# EAGLE design BusPirate-v4_ecard (EAGLE 8.4.0)
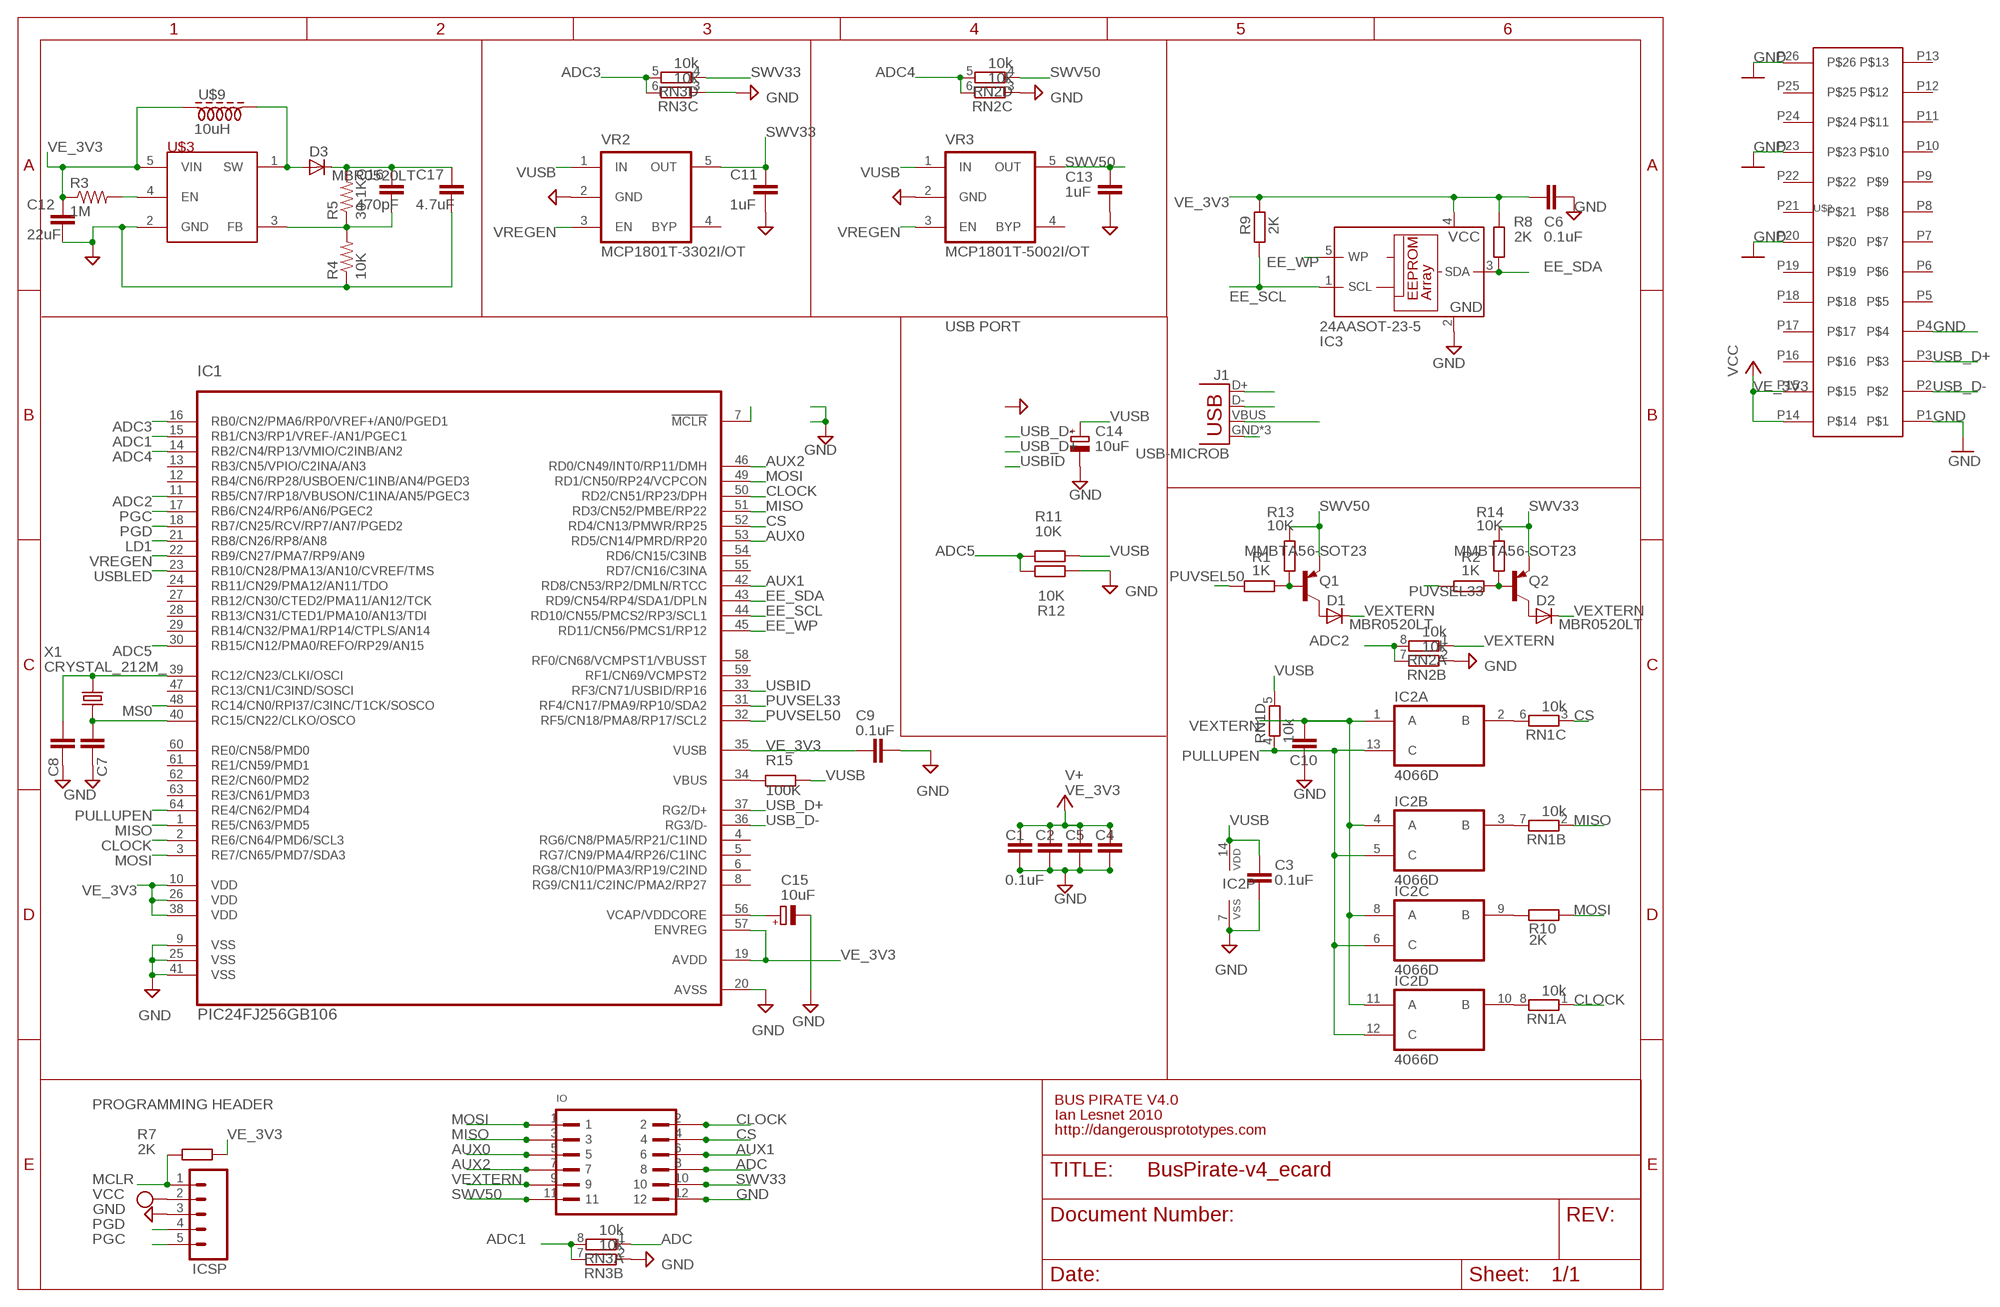
[diagram p0: schematic, sheet 1]

## Parts
C1  0.1uF  C-EUC0603  [C0603]
C2  0.1uF  C-EUC0603  [C0603]
C3  0.1uF  C-EUC0603  [C0603]
C4  0.1uF  C-EUC0603  [C0603]
C5  0.1uF  C-EUC0603  [C0603]
C6  0.1uF  C-EUC0603  [C0603]
C7  27pF  C-EUC0603  [C0603]
C8  27pF  C-EUC0603  [C0603]
C9  0.1uF  C-EUC0603  [C0603]
C10  0.1uF  C-EUC0603  [C0603]
C11  1uF  C-EUC0603  [C0603]
C12  22uF  C-EUC0603  [C0603]
C13  1uF  C-EUC0603  [C0603]
C14  10uF  CPOL-EUSMCA  [SMC_A]
C15  10uF  CPOL-EUSMCA  [SMC_A]
C16  470pF  C-EUC0603  [C0603]
C17  4.7uF  C-EUC0603  [C0603]
D1  MBR0520LT  [SOD123]
D2  MBR0520LT  [SOD123]
D3  MBR0520LT  [SOD123]
IC1  PIC24FJ256GB106  [TQFP64-10X10]
IC2  4066D  [SO14]
IC3  24AASOT-23-5  24AA  [SOT-23-5]
ICSP  ICSP  M05  [1X05]
IO  PINSHRD-PTH-2X06  [PINSHRD_PTH_2X06]
J1  USB-MICROB  [USB-MICROB]
Q1  MMBTA56-SOT23  [SOT23]
Q2  MMBTA56-SOT23  [SOT23]
R1  1K  R-EU_R0603  [R0603]
R2  1K  R-EU_R0603  [R0603]
R3  1M  R-US_R0603  [R0603]
R4  10K  R-US_R0603  [R0603]
R5  30.1K  R-US_R0603  [R0603]
R7  2K  R-EU_R0603  [R0603]
R8  2K  R-EU_R0603  [R0603]
R9  2K  R-EU_R0603  [R0603]
R10  2K  R-EU_R0603  [R0603]
R11  10K  R-EU_R0603  [R0603]
R12  10K  R-EU_R0603  [R0603]
R13  10K  R-EU_R0603  [R0603]
R14  10K  R-EU_R0603  [R0603]
R15  100K  R-EU_R0603  [R0603]
RN1  10k  RNETWORK  [RN8P-4R-CRA06S]
RN2  10k  RNETWORK  [RN8P-4R-CRA06S]
RN3  10k  RNETWORK  [RN8P-4R-CRA06S]
U$2  EXPRESSCARD  [EXPRESSCARD_EXPRESSCARD_PACK]
U$3  LMR62421  [SOT23-DBV]
U$9  10uH  SMD_IND  [2520(1008)]
VR2  MCP1801T-3302I/OT  MIC5205  [SOT-23-5]
VR3  MCP1801T-5002I/OT  MIC5205  [SOT-23-5]
X1  CRYSTAL_212M_  [4X6]

## Nets
ADC: IO.8 RN3.1
ADC1: IC1.15(RB1/CN3/RP1/VREF-/AN1/PGEC1) RN3.7 RN3.8
ADC2: IC1.11(RB5/CN7/RP18/VBUSON/C1INA/AN5/PGEC3) RN2.7 RN2.8
ADC3: IC1.16(RB0/CN2/PMA6/RP0/VREF+/AN0/PGED1) RN3.5 RN3.6
ADC4: IC1.14(RB2/CN4/RP13/VMIO/C2INB/AN2) RN2.5 RN2.6
ADC5: IC1.30(RB15/CN12/PMA0/REFO/RP29/AN15) R11.2 R12.2
AUX0: IC1.53(RD5/CN14/PMRD/RP20) IO.5
AUX1: IC1.42(RD8/CN53/RP2/DMLN/RTCC) IO.6
AUX2: IC1.46(RD0/CN49/INT0/RP11/DMH) IO.7
CLOCK: IC1.2(RE6/CN64/PMD6/SCL3) IC1.50(RD2/CN51/RP23/DPH) IO.2 RN1.1
CS: IC1.52(RD4/CN13/PMWR/RP25) IO.4 RN1.3
EE_SCL: IC1.44(RD10/CN55/PMCS2/RP3/SCL1) IC3.1(SCL) R9.1
EE_SDA: IC1.43(RD9/CN54/RP4/SDA1/DPLN) IC3.3(SDA) R8.1
EE_WP: IC1.45(RD11/CN56/PMCS1/RP12) IC3.5(WP)
GND: C1.2 C2.2 C3.2 C4.2 C5.2 C6.2 C7.2 C8.2 C9.2 C10.2 C11.2 C12.2 C13.2 C14.- C15.- C17.2 IC1.9(VSS) IC1.20(AVSS) IC1.25(VSS) IC1.41(VSS) IC2.7(P:VSS) IC3.2(GND) ICSP.3 IO.12 J1.GND J1.MT1(GND) J1.MT2(GND) R4.1 R12.1 RN2.2 RN2.3 RN3.2 RN3.3 U$2.P1 U$2.P4 U$2.P20 U$2.P23 U$2.P26 U$3.2(GND) VR2.2(GND) VR3.2(GND)
LD1: IC1.21(RB8/CN26/RP8/AN8)
MCLR: IC1.7(!MCLR) ICSP.1 R7.1
MISO: IC1.1(RE5/CN63/PMD5) IC1.51(RD3/CN52/PMBE/RP22) IO.3 RN1.2
MOSI: IC1.3(RE7/CN65/PMD7/SDA3) IC1.49(RD1/CN50/RP24/VCPCON) IO.1 R10.1
MS0: IC1.48(RC14/CN0/RPI37/C3INC/T1CK/SOSCO)
N$1: IC2.9(C:B) R10.2
N$2: IC2.10(D:B) RN1.8
N$3: D1.A Q1.3(C)
N$4: IC2.2(A:B) RN1.6
N$5: IC2.3(B:B) RN1.7
N$6: D3.A U$3.1(SW) U$9.2
N$7: R3.2 U$3.4(EN)
N$8: Q2.1(B) R2.1 R14.2
N$9: C7.1 IC1.40(RC15/CN22/CLKO/OSCO) X1.2(X2)
N$10: C15.+ IC1.56(VCAP/VDDCORE)
N$11: IC1.34(VBUS) R15.2
N$12: C8.1 IC1.39(RC12/CN23/CLKI/OSCI) X1.1(X1)
N$14: D2.A Q2.3(C)
N$15: C16.2 R4.2 R5.1 U$3.3(FB)
N$17: Q1.1(B) R1.1 R13.2
PGC: IC1.17(RB6/CN24/RP6/AN6/PGEC2) ICSP.5
PGD: IC1.18(RB7/CN25/RCV/RP7/AN7/PGED2) ICSP.4
PULLUPEN: IC1.64(RE4/CN62/PMD4) IC2.5(B:C) IC2.6(C:C) IC2.12(D:C) IC2.13(A:C) RN1.4
PUVSEL33: IC1.31(RF4/CN17/PMA9/RP10/SDA2) R2.2
PUVSEL50: IC1.32(RF5/CN18/PMA8/RP17/SCL2) R1.2
SWV33: C11.1 IO.10 Q2.2(E) R14.1 RN3.4 VR2.5(OUT)
SWV50: C13.1 IO.11 Q1.2(E) R13.1 RN2.4 VR3.5(OUT)
USB_D+: IC1.37(RG2/D+) J1.D+ U$2.P3
USB_D-: IC1.36(RG3/D-) J1.D- U$2.P2
USBID: IC1.33(RF3/CN71/USBID/RP16)
USBLED: IC1.23(RB10/CN28/PMA13/AN10/CVREF/TMS)
VE_3V3: C1.1 C2.1 C4.1 C5.1 C6.1 C9.1 C12.1 IC1.10(VDD) IC1.19(AVDD) IC1.26(VDD) IC1.35(VUSB) IC1.38(VDD) IC1.57(ENVREG) IC3.4(VCC) ICSP.2 R3.1 R7.2 R8.2 R9.2 U$2.P14 U$2.P15 U$3.5(VIN) U$9.1 ; supply symbol labelled VCC, V+
VEXTERN: C10.1 D1.C D2.C IC2.1(A:A) IC2.4(B:A) IC2.8(C:A) IC2.11(D:A) IO.9 RN2.1
VREGEN: IC1.22(RB9/CN27/PMA7/RP9/AN9) VR2.3(EN) VR3.3(EN)
VUSB: C3.1 C14.+ C16.1 C17.1 D3.C IC2.14(P:VDD) J1.VBUS R5.2 R11.1 R15.1 RN1.5 VR2.1(IN) VR3.1(IN)
Unconnected: IC1.4(RG6/CN8/PMA5/RP21/C1IND) IC1.5(RG7/CN9/PMA4/RP26/C1INC) IC1.6(RG8/CN10/PMA3/RP19/C2IND) IC1.8(RG9/CN11/C2INC/PMA2/RP27) IC1.12(RB4/CN6/RP28/USBOEN/C1INB/AN4/PGED3) IC1.13(RB3/CN5/VPIO/C2INA/AN3) IC1.24(RB11/CN29/PMA12/AN11/TDO) IC1.27(RB12/CN30/CTED2/PMA11/AN12/TCK) IC1.28(RB13/CN31/CTED1/PMA10/AN13/TDI) IC1.29(RB14/CN32/PMA1/RP14/CTPLS/AN14) IC1.47(RC13/CN1/C3IND/SOSCI) IC1.54(RD6/CN15/C3INB) IC1.55(RD7/CN16/C3INA) IC1.58(RF0/CN68/VCMPST1/VBUSST) IC1.59(RF1/CN69/VCMPST2) IC1.60(RE0/CN58/PMD0) IC1.61(RE1/CN59/PMD1) IC1.62(RE2/CN60/PMD2) IC1.63(RE3/CN61/PMD3) U$2.P5 U$2.P6 U$2.P7 U$2.P8 U$2.P9 U$2.P10 U$2.P11 U$2.P12 U$2.P13 U$2.P16 U$2.P17 U$2.P18 U$2.P19 U$2.P21 U$2.P22 U$2.P24 U$2.P25 VR2.4(BYP) VR3.4(BYP)

## Notes on the sheet
- USB PORT
- BUS PIRATE V4.0
- PROGRAMMING HEADER
- Ian Lesnet 2010
- http://dangerousprototypes.com

## Library data of the parts
C1-C13 C16 C17 = rcl:C-EU: CAPACITOR, European symbol
C14 C15 = rcl:CPOL-EU: POLARIZED CAPACITOR, European symbol
D1-D3 = diode:MBR0520LT: SCHOTTKY BARRIER RECTIFIER Source: http://onsemi.com .. MBR0520LT1-D.pdf
IC1 = dp_devices:PIC24FJ256GB106: 16-Bit Flash Microcontroller with USB On-The-Go(OTG)
IC2 = 40xx:4066: Quad bilateral ANALOG SWITCH
IC3 = dp_devices:24AA*; 24AA: 24AA
ICSP = SparkFun:M05: Header 5 Standard 5-pin 0.1" header. Use with straight break away headers (SKU : PRT-00116), right angle break away headers (PRT-00553), swiss pins (PRT-00743), machine pins (PRT-00117), and female headers (PRT-00115). Molex polarized connector foot print use with SKU : PRT-08230 with associated crimp pins and housings.
IO = dp_devices:PINSHRD-PTH-2X06: Shrouded pin header, 2.54mm pitch
J1 = SparkFun-Connectors:USB: USB Connectors USB-B-PTH is fully proven SKU : PRT-00139/CONN-08278 USB-miniB is fully proven SKU : PRT-00587 USB-A-PCB is untested. USB-A-H is throughly reviewed, but untested. Spark Fun Electronics SKU : PRT-00437 USB-B-SMT is throughly reviewed, but untested. Needs silkscreen touching up. USB-A-S has not been used/tested USB-MB-H has not been used/tested USB-MICROB has been used. CONN-09505; PROD_ID: CONN-09505
Q1 Q2 = transistor-pnp:*-?: PNP Transistor
R1 R2 R7-R10 R13-R15 = rcl:R-EU_: RESISTOR, European symbol
R3-R5 = resistor:R-US_: RESISTOR, American symbol
R11 R12 = resistor:R-EU_: RESISTOR, European symbol
RN1-RN3 = dp_devices:RNETWORK: 4 Resistor Array 0603
U$2 = bp_4E:EXPRESSCARD
U$3 = bp_4E:LMR62421
U$9 = expresscard:SMD_IND
VR2 VR3 = dp_devices:MIC5205: 150ma Low-Noise LDO Regulator
X1 = dp_devices:CRYSTAL_2

## Board
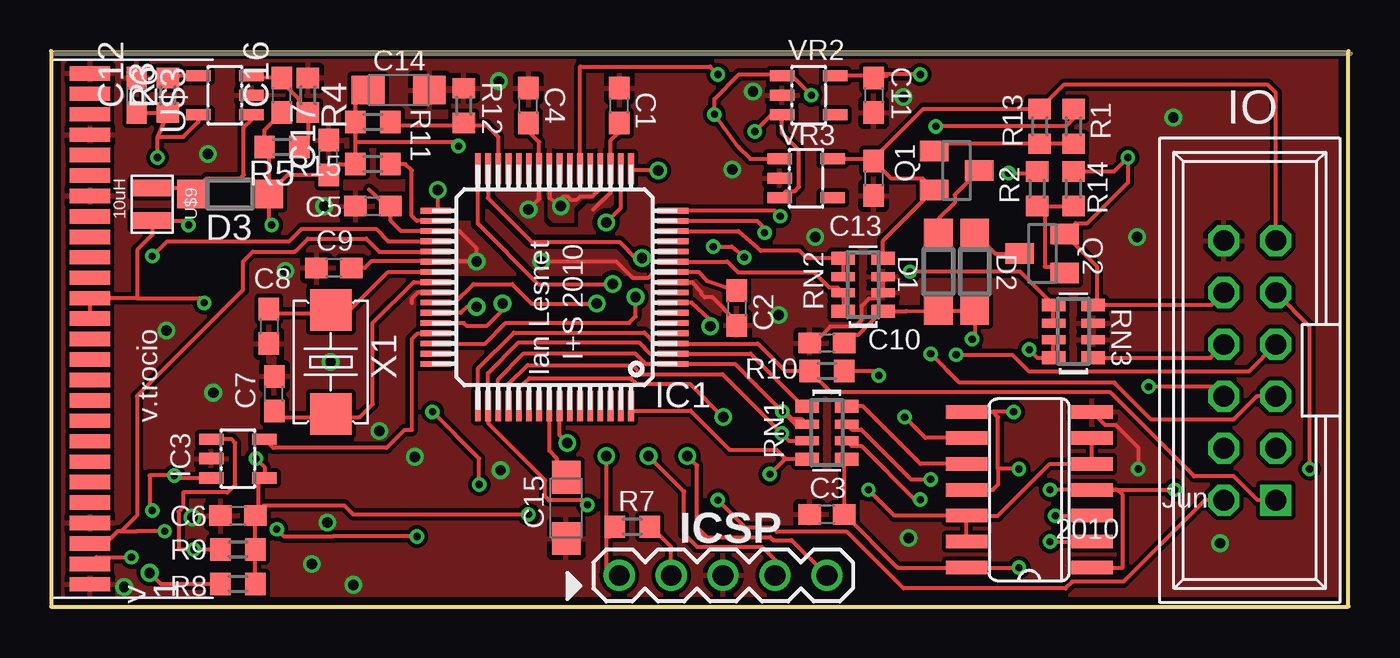
[diagram p1: board, top side]
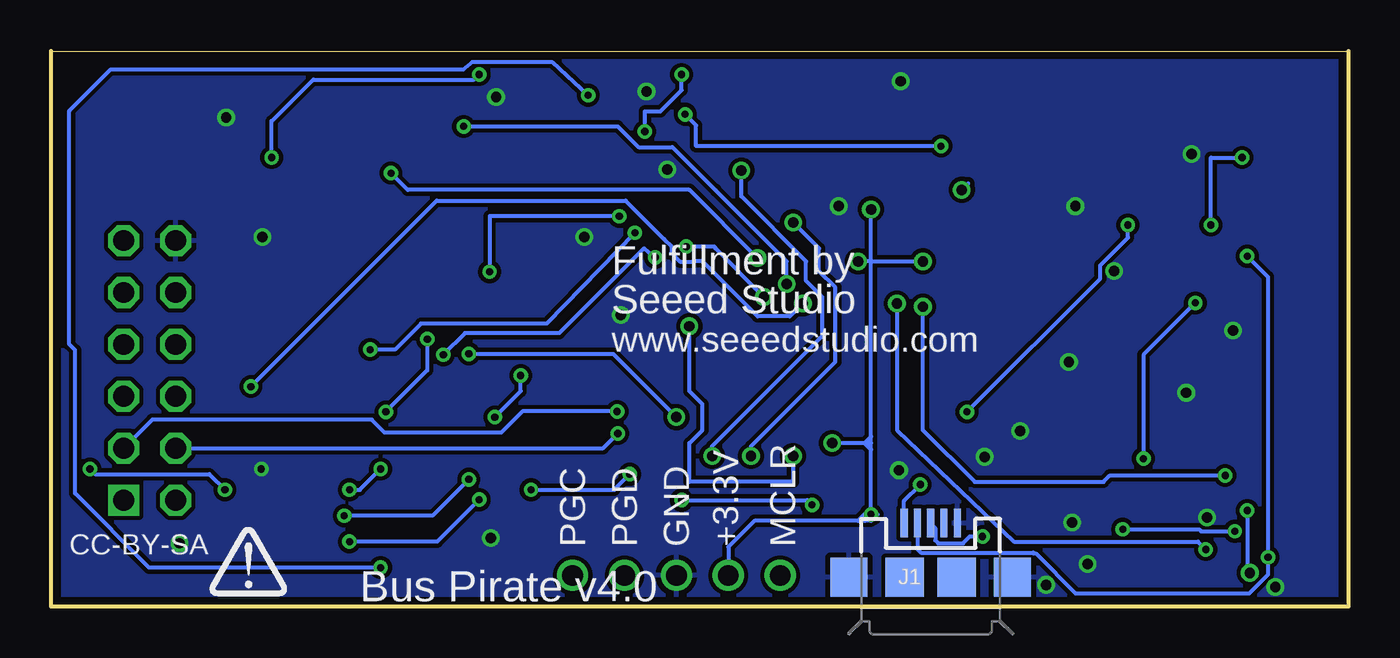
[diagram p2: board, bottom side, seen from below]

Size 63.5 x 27.18 mm. Coordinates in mm from the lower left corner, seen from the top.
Outline: 0,27.18 0,0 63.5,0 63.5,27.18 0,27.18
Copper layers (1*16): Top 0.0356mm / dielectric 1.5011mm / Bottom 0.0356mm
Design rules "oshpark-2layer": minimum track width 6mil, minimum drill 13mil, track to track 6mil, track to pad 6mil, pad to pad 6mil, via to via 6mil, smd to smd 6mil, copper to edge 15mil, drill to drill 6mil, minimum pad ring 7mil, minimum via ring 7mil, stop-mask expansion 2.5mil, vias tented up to drill 0mil, thermal gap 10mil

### Footprints (pad centres in the part's own frame; a part is rotated, then mirrored left to right if it is on the bottom)
C0603 = smd 1.1 x 1: 1 -0.85,0; 2 0.85,0
SMC_A = smd 1.6 x 1.4: + -1.5,0; - 1.5,0
SOD123 = smd 1.4 x 1.4: A 1.9,0; C -1.9,0
TQFP64-10X10 = smd 1.5 x 0.28: 1 -5.8,3.75; 2 -5.8,3.25; 3 -5.8,2.75; 4 -5.8,2.25; 5 -5.8,1.75; 6 -5.8,1.25; 7 -5.8,0.75; 8 -5.8,0.25; 9 -5.8,-0.25; 10 -5.8,-0.75; 11 -5.8,-1.25; 12 -5.8,-1.75; 13 -5.8,-2.25; 14 -5.8,-2.75; 15 -5.8,-3.25; 16 -5.8,-3.75; 33 5.8,-3.75; 34 5.8,-3.25; 35 5.8,-2.75; 36 5.8,-2.25; 37 5.8,-1.75; 38 5.8,-1.25; 39 5.8,-0.75; 40 5.8,-0.25; 41 5.8,0.25; 42 5.8,0.75; 43 5.8,1.25; 44 5.8,1.75; 45 5.8,2.25; 46 5.8,2.75; 47 5.8,3.25; 48 5.8,3.75 | smd 0.28 x 1.5: 17 -3.75,-5.8; 18 -3.25,-5.8; 19 -2.75,-5.8; 20 -2.25,-5.8; 21 -1.75,-5.8; 22 -1.25,-5.8; 23 -0.75,-5.8; 24 -0.25,-5.8; 25 0.25,-5.8; 26 0.75,-5.8; 27 1.25,-5.8; 28 1.75,-5.8; 29 2.25,-5.8; 30 2.75,-5.8; 31 3.25,-5.8; 32 3.75,-5.8; 49 3.75,5.8; 50 3.25,5.8; 51 2.75,5.8; 52 2.25,5.8; 53 1.75,5.8; 54 1.25,5.8; 55 0.75,5.8; 56 0.25,5.8; 57 -0.25,5.8; 58 -0.75,5.8; 59 -1.25,5.8; 60 -1.75,5.8; 61 -2.25,5.8; 62 -2.75,5.8; 63 -3.25,5.8; 64 -3.75,5.8
SO14 = smd 0.66 x 2.032: 1 -3.81,-3.073; 2 -2.54,-3.073; 3 -1.27,-3.073; 4 0,-3.073; 5 1.27,-3.073; 6 2.54,-3.073; 7 3.81,-3.073; 8 3.81,3.073; 9 2.54,3.073; 10 1.27,3.073; 11 0,3.073; 12 -1.27,3.073; 13 -2.54,3.073; 14 -3.81,3.073
SOT-23-5 = smd 0.55 x 1.2: 1 -0.95,-1.3; 2 0,-1.3; 3 0.95,-1.3; 4 0.95,1.3; 5 -0.95,1.3
1X05 = drill 1.016: 1 0,0; 2 2.54,0; 3 5.08,0; 4 7.62,0; 5 10.16,0
PINSHRD_PTH_2X06 = drill 1.016 square: 1 -6.35,-1.27 | drill 1.016 octagon: 2 -6.35,1.27; 3 -3.81,-1.27; 4 -3.81,1.27; 5 -1.27,-1.27; 6 -1.27,1.27; 7 1.27,-1.27; 8 1.27,1.27; 9 3.81,-1.27; 10 3.81,1.27; 11 6.35,-1.27; 12 6.35,1.27
USB-MICROB = smd 0.35 x 1.4: D+ 0,2.65; D- -0.65,2.65; GND 1.3,2.65; ID 0.65,2.65; VBUS -1.3,2.65 | smd 1.8 x 1.9: MT1 -4,0; MT2 4,0 | smd 1.9 x 1.9: P$1 -1.27,0; P$2 1.27,0
SOT23 = smd 1 x 1.4: 1 -0.95,-1.1; 2 0.95,-1.1; 3 0,1.1
R0603 = smd 1 x 1.1: 1 -0.85,0; 2 0.85,0
RN8P-4R-CRA06S = smd 0.63 x 1.15: 1 -1.295,-0.975; 4 1.295,-0.975; 5 1.295,0.975; 8 -1.295,0.975 | smd 0.44 x 1.15: 2 -0.4,-0.975; 3 0.4,-0.975; 6 0.4,0.975; 7 -0.4,0.975
EXPRESSCARD_EXPRESSCARD_PACK = smd 0.7 x 2: P1 -12.5,0; P2 -11.5,0; P3 -10.5,0; P4 -9.5,0; P5 -8.5,0; P6 -7.5,0; P7 -6.5,0; P8 -5.5,0; P9 -4.5,0; P10 -3.5,0; P11 -2.5,0; P12 -1.5,0; P13 -0.5,0; P14 0.5,0; P15 1.5,0; P16 2.5,0; P17 3.5,0; P18 4.5,0; P19 5.5,0; P20 6.5,0; P21 7.5,0; P22 8.5,0; P23 9.5,0; P24 10.5,0; P25 11.5,0; P26 12.5,0
SOT23-DBV = smd 0.55 x 1.2: 1 -0.95,-1.3; 2 0,-1.3; 3 0.95,-1.3; 4 0.95,1.3; 5 -0.95,1.3
2520(1008) = smd 0.8 x 2: 1 0.8,0; 2 -0.8,0
4X6 = smd 2.032 x 2.032: 1 -2.54,0; 2 2.54,0

### Placement (x,y rotation side)
C1  27.81,24.51 90 top
C2  33.55,14.61 270 top
C3  37.97,4.51 180 top
C4  23.37,24.51 90 top
C5  15.75,19.59 180 top
C6  9.14,4.45 180 top
C7  10.92,10.41 90 top
C8  10.67,13.72 270 top
C9  13.84,16.57 180 top
C10  37.97,12.89 180 top
C11  40.26,25.02 270 top
C12  4.19,25.02 90 top
C13  40.26,20.96 270 top
C14  17.02,25.27 0 top
C15  25.21,4.83 270 top
C16  11.3,25.02 90 top
C17  13.59,21.97 90 top
D1  43.43,16.38 90 top
D2  45.21,16.38 90 top
D3  8.76,20.19 180 top
IC1  24.64,15.62 180 top
IC2  47.88,5.71 90 top
IC3  9.14,7.24 270 top
ICSP  27.81,1.52 0 top
IO  58.67,11.56 90 top
J1  20.45,1.44 0 bottom
Q1  44.32,21.34 270 top
Q2  48.51,17.27 90 top
R1  50.04,23.5 90 top
R2  48.26,20.45 90 top
R3  5.71,25.02 90 top
R4  12.57,25.02 270 top
R5  11.3,22.48 180 top
R7  28.45,3.91 0 top
R8  9.14,1.11 0 top
R9  9.14,2.79 0 top
R10  37.97,11.53 0 top
R11  15.75,23.72 0 top
R12  20.19,24.51 270 top
R13  48.39,23.5 270 top
R14  50.04,20.45 270 top
R15  15.75,21.65 0 top
RN1  37.97,8.51 270 top
RN2  39.75,15.75 90 top
RN3  50.04,13.46 90 top
U$1  [DP-LOGO]  55.75,0.51 0 bottom
U$2  1.91,13.59 90 top
U$3  8.51,25.02 90 top
U$9  4.95,19.69 270 top
VR2  37.08,25.02 270 top
VR3  36.96,20.96 270 top
X1  13.68,11.97 270 top

### Tracks (layer width: path | path; a pad name or v marks a point on that pad's centre or on a via)
ADC
  Top 0.203: RN3.1 56.74,12.17 IO.8
ADC1  (via drill 0.35)
  Top 0.203: IC1.15 34.56,18.87 34.92,18.5 v34.92,18.29 | v47.88,12.57 48.28,12.17 RN3.8 RN3.7
  Bottom 0.203: v47.88,12.57 46.67,12.57 45.4,13.84 39.25,13.84 v34.92,18.29
ADC2
  Top 0.203: RN2.8 RN2.7 38.5,15.62 38.07,15.62 37.34,16.35 33.62,16.35 33.11,16.87 IC1.11
ADC3  (via drill 0.35)
  Top 0.203: IC1.16 35.41,19.37 v35.69,19.1 | RN3.6 RN3.5 47.44,16.38 v42.04,16.38
  Bottom 0.203: v42.04,16.38 42.04,19.1 v35.69,19.1
ADC4
  Top 0.203: IC1.14 33.64,18.37 34.74,17.4 36.64,17.4 37,17.04 RN2.5 RN2.6
ADC5
  Top 0.203: R11.2 16.6,23.66 16.7,23.56 20.09,23.56 R12.2 20.3,23.56 21.3,23.56 21.89,22.98 IC1.30
AUX0  (via drill 0.35, 0.51)
  Top 0.203: IC1.53 22.89,10.7 23.41,11.18 28.37,11.18 28.65,10.9 31.27,10.9 v32.89,9.27 | IO.5 59.02,10.29 57.88,9.14 53.87,9.14 52.05,10.96 44.46,10.96 v43.05,12.36
  Bottom 0.203: v43.05,12.36 35.99,12.36 v32.89,9.27
AUX1  (via drill 0.35, 0.51)
  Top 0.203: IC1.42 19.76,14.87 20.67,15.78 22.57,15.78 23.53,14.83 v26.7,14.83 | IO.6 56.93,10.76 v53.72,10.76
  Bottom 0.203: v26.7,14.83 27.34,14.19 28.92,14.19 31.62,16.89 32.05,16.89 32.09,16.89 32.1,16.88 32.71,16.88 33.14,17.31 33.14,17.63 33.5,17.98 35.37,19.86 44.63,19.86 v53.72,10.76
AUX2  (via drill 0.35, 0.51)
  Top 0.203: IC1.46 21.25,12.87 22.26,13.88 28.29,13.88 28.61,14.19 v28.61,15.14 | v44.3,12.32 47.06,12.32 47.86,11.52 58.64,11.52 IO.7 | v32.41,17.61 33.33,17.61 v33.93,17.09
  Bottom 0.203: v28.61,15.14 30.99,17.53 arc-90 31.07,17.61 v32.41,17.61 | v44.3,12.32 43.24,13.38 38.63,13.38 34.49,17.53 34,17.09 v33.93,17.09
CLOCK  (via drill 0.35)
  Top 0.203: RN1.1 36.8,9.8 34.24,12.37 IC1.2 29.32,12.37 28.77,12.92 22.89,12.92 21.39,11.42 IC1.50 21.42,9.79 21.42,8.93 24.18,6.17 24.18,5.39 24.37,5.2 26.03,5.2 v26.25,4.98 | IO.2 56.47,5.21 52.48,1.22 52.12,1.22 49.99,1.22 49.66,0.89 41.72,0.89 38.96,3.65 35.51,3.65 35.3,3.86 33.99,3.86 v32.64,5.21
  Bottom 0.203: v32.64,5.21 26.48,5.21 v26.25,4.98
CS  (via drill 0.35)
  Top 0.203: IC1.52 22.39,10.91 23.33,11.81 28.45,11.81 28.88,11.37 32.85,11.37 34.18,10.05 | 34.18,10.05 34.32,9.91 | 35.83,8.4 34.18,10.05 | 35.83,8.4 36.12,8.11 RN1.3 | v35.76,8.47 35.83,8.4
  Bottom 0.203: IO.4 36.48,7.75 v35.76,8.47
EE_SCL  (via drill 0.35, 0.51)
  Top 0.203: IC1.44 20.2,13.87 20.35,13.72 21.3,13.72 22.1,14.51 v22.1,14.83 | R9.1 v6.99,2.79 6.22,2.79 6.24,2.81 6.24,4.65 6.48,4.89 6.48,5.59 8.64,5.59 9.02,5.97 9.02,8 8.83,8.19 IC3.1
  Bottom 0.203: v22.1,14.83 22.1,8.64 16.38,3.17 7.37,3.17 v6.99,2.79
EE_SDA  (via drill 0.35, 0.51)
  Top 0.203: IC1.43 20.05,14.37 20.35,14.67 v20.83,14.67 | R8.1 5.37,1.11 v4.83,1.65 | IC3.3 6.16,6.29 v6.03,6.41 4.83,6.41 4.83,4.83 v4.95,4.7
  Bottom 0.203: v20.83,14.67 20.83,8.64 18.29,6.1 11.99,6.1 11.67,6.41 v6.03,6.41 | v4.95,4.7 4.95,1.78 v4.83,1.65
EE_WP
  Top 0.203: IC1.45 17.94,13.37 17.65,13.08 17.65,8.64 17.29,8.64 16.41,7.76 10.88,7.76 10.46,8.17 | 10.46,8.17 10.63,8 | 10.46,8.17 IC3.5
GND  (via drill 0.35, 0.51)
  Top 0.203: IC1.25 24.39,20 v24.95,19.59 24.95,19.95 25.07,20.07 25.27,20.07 25.43,19.91 25.75,19.91 25.91,20.07 26.5,20.07 26.89,20.45 IC1.20 | IC1.41 17.96,15.37 17.65,15.07 17.65,14.86 | IC1.9 31.37,15.87 31.82,15.39 31.82,15.31 32,15.13 32.36,15.13 33.55,13.95 C2.2 | RN2.3 RN2.2 40.45,15.07 40.02,15.07 39.66,14.7 39.66,14.01 39.34,13.7 38.15,13.7 37.34,12.89 C10.2 | IC2.7 51.59,8.89 52.09,8.89 53.21,7.77 v53.21,6.73
  other vias: 13.37,19.59 22,6.67 11.46,16.41 13.68,11.97 16.07,8.6 17.81,7.33 6.92,4.37 7.94,10.46 12.76,2.08 53.15,18.08 13.53,4.11 54.93,23.92 57.21,3.1 41.97,3.35 35.62,14.27 37.4,18.08 33.34,21.38 41.72,24.94 34.35,25.19 5.65,13.51 14.8,1.06 21.91,25.7 7.68,22.15 3.58,0.95
  pour Top (isolate 0.203, rank 2): 0.25,29.72 63.75,29.72 63.5,0 0,0
  pour Bottom (isolate 0.203, rank 2): 0,29.72 63.5,29.72 arc-3 63.5,0 0,0
MCLR  (via drill 0.51)
  Top 0.203: IC1.7 31.35,14.87 32.26,14.03 v32.26,13.72 | 27.18,3.56 27.18,1.65 ICSP.1 | 27.18,3.56 v27.18,7.37 | R7.1 27.34,3.4 27.18,3.56
  Bottom 0.203: v32.26,13.72 32.26,10.54 31.62,9.91 31.62,8.64 32.26,8 32.26,6.1 27.18,6.1 v27.18,7.37
MISO  (via drill 0.35)
  Top 0.203: IC1.51 21.89,11.13 23.14,12.38 28.59,12.38 29.1,11.87 IC1.1 33.47,11.87 34.48,10.86 36.43,8.91 RN1.2 36.75,9.16 36.29,9.16 35.9,9.55 v35.79,9.55
  Bottom 0.203: IO.3 58.55,9.14 47.81,9.14 47.18,8.51 41.47,8.51 40.43,9.55 v35.79,9.55
MOSI
  Top 0.203: IC1.49 20.89,9.81 20.91,9.87 20.91,11.65 22.65,13.4 29.04,13.4 29.57,12.87 IC1.3 34.59,12.87 35.93,11.53 R10.1 38.17,10.47 51.85,10.47 55.95,6.38 57.89,6.38 59.06,5.21 IO.1
MS0
  Top 0.203: 18.92,11.86 18.85,11.86 IC1.48
N$1  (via drill 0.35)
  Top 0.203: IC2.9 42.8,8.26 v41.78,9.27 | v40.51,11.3 40.29,11.53 R10.2
  Bottom 0.203: v41.78,9.27 40.51,10.54 v40.51,11.3
N$2
  Top 0.203: IC2.10 42.55,6.98 39.73,9.8 RN1.8
N$3
  Top 0.203: Q1.3 44.23,20.14 44.23,19.76 43.43,18.97 D1.A
N$4  (via drill 0.35)
  Top 0.203: RN1.6 39.2,7.86 39.66,7.86 42.29,5.23 v42.55,5.23 | v48.89,3.17 IC2.2
  Bottom 0.203: v42.55,5.23 44.6,3.17 v48.89,3.17
N$5  (via drill 0.35)
  Top 0.203: RN1.7 39.2,8.66 39.66,8.66 42.09,6.23 v43.05,6.23 | v49.15,4.45 IC2.3
  Bottom 0.203: v43.05,6.23 44.83,4.45 v49.15,4.45
N$6
  Top 0.203: U$9.2 6.57,20.49 D3.A 7.62,20.96 9.27,20.96 9.43,21.12 9.43,23.45 9.81,23.82 U$3.1
N$7
  Top 0.203: U$3.4 5.81,25.97 R3.2
N$8
  Top 0.203: R2.1 | R2.1 R14.2 | R2.1 arc-90 48.64,19.22 48.64,16.64 49.3,16.64 arc-90 Q2.1
N$9
  Top 0.203: C7.1 10.88,9.27 13.21,9.27 13.37,9.43 X1.2 13.84,9.27 15.11,9.27 15.75,9.91 15.75,13.88 17.74,15.87 IC1.40
N$10
  Top 0.203: IC1.56 24.39,7.62 24.77,7.24 24.77,6.77 C15.+
N$11
  Top 0.203: IC1.34 17.89,18.87 17.65,19.11 17.65,21.34 17.34,21.65 R15.2
N$12
  Top 0.203: C8.1 10.67,14.35 | 10.67,14.35 | 10.67,14.35 13.53,14.35 X1.1 13.84,14.35 14.48,14.35 16.5,16.37 IC1.39
N$14
  Top 0.203: D2.A 46.22,17.27 Q2.3
N$15
  Top 0.203: R5.1 12.57,22.9 R4.2 12.11,24.63 12.11,24.85 11.3,25.65 C16.2 9.91,25.87 U$3.3
N$17
  Top 0.203: R1.1 R13.2 43.58,22.65 Q1.1 | R1.1
PGC  (via drill 0.51)
  Top 0.203: 28.45,21.34 28.43,21.32 | v29.72,21.34 28.45,21.34 | v31.15,7.37 31.62,6.89 31.62,3.87 32.1,3.4 35.19,3.4 35.34,3.25 36.25,3.25 ICSP.5 | 28.45,21.34 28.45,21.36 IC1.17
  Bottom 0.203: v29.72,21.34 29.72,20.07 26.54,16.89 26.54,15.94 25.75,15.14 25.75,13.24 31.15,7.84 v31.15,7.37
PGD  (via drill 0.51)
  Top 0.203: v27.18,18.8 27.89,19.51 IC1.18 | ICSP.4 35.43,1.18 35.43,2.29 34.8,2.92 31.62,2.92 30.99,3.56 30.99,5.62 v29.24,7.37
  Bottom 0.203: v27.18,18.8 25.91,17.53 25.91,16.41 25.11,15.62 25.11,11.97 29.24,7.84 v29.24,7.37
PULLUPEN  (via drill 0.35)
  Top 0.203: IC1.64 28.39,9.65 28.45,9.59 31.31,9.59 33.21,7.68 35.5,7.68 35.94,7.24 | IC2.13 IC2.12 | IC2.6 IC2.5 48.89,6.98 46.35,4.45 IC2.12 | 35.94,7.24 36.97,7.24 RN1.4 | IC2.12 41.27,4.45 v40,5.71 | v35.18,6.48 35.94,7.24
  Bottom 0.203: v40,5.71 35.94,5.71 v35.18,6.48
PUVSEL33  (via drill 0.35, 0.51)
  Top 0.203: IC1.31 21.39,19.98 23.53,17.84 27.81,17.84 28.61,17.05 v28.92,17.05 | v46.86,21.21 48.17,21.21 R2.2
  Bottom 0.203: v28.92,17.05 32.26,20.38 46.04,20.38 v46.86,21.21
PUVSEL50  (via drill 0.35, 0.51)
  Top 0.203: IC1.32 20.89,18.74 23.84,15.78 v27.5,15.78 | R1.2 50.04,23.88 49.66,23.5 v43.31,23.5
  Bottom 0.203: v27.5,15.78 27.5,16.89 30.96,20.35 | 30.96,20.35 30.99,20.38 | v43.31,23.5 35.77,23.5 34.75,22.48 33.09,22.48 30.96,20.35
SWV33  (via drill 0.35)
  Top 0.203: 40.26,25.97 VR2.5 | 40.26,25.97 40.89,25.97 C11.1 | IO.10 56.79,14.76 51.18,14.76 | 51.18,14.76 RN3.4 | R14.1 52.03,21.3 v52.7,21.97 52.7,20.75 50.73,18.77 50.16,18.77 Q2.2 51.18,16.66 51.18,14.76 | v42.55,26.04 40.32,26.04 40.26,25.97
  Bottom 0.203: v52.7,21.97 52.7,23.75 50.67,25.78 42.8,25.78 v42.55,26.04
SWV50
  Top 0.203: IO.11 59.94,25.15 59.56,25.53 49.57,25.53 R13.1 42.7,24.35 40.26,21.91 C13.1 | C13.1 41.11,20.96 42.65,20.96 Q1.2 40.73,17.89 RN2.4 | VR3.5 40.16,21.91 C13.1
USB_D+  (via drill 0.35)
  Top 0.203: IC1.37 16.06,17.37 15.43,18 12.57,18 11.94,17.37 9.88,17.37 9.4,16.89 9.4,15.49 4.19,10.29 4.21,10.27 4.21,4.47 3.43,3.68 | U$2.P3 2.67,3.09 3.26,3.68 3.43,3.68 | v17.91,3.43 13.81,3.43 11.41,3.43 v11.05,3.78 | v5.56,3.68 4.21,3.68 | 4.21,3.68 4.19,3.71 | 3.43,3.68 4.21,3.68
  Bottom 0.203: J1.D+ 20.23,3.83 20.23,3.24 20.08,3.09 18.87,3.09 18.53,3.43 v17.91,3.43 | v11.05,3.78 7.31,3.78 7.2,3.68 6.64,3.68 6.63,3.68 v5.56,3.68
USB_D-  (via drill 0.35)
  Top 0.203: IC1.36 16.51,17.87 16.5,17.88 15.91,18.48 12.26,18.48 11.65,17.87 5.68,17.87 v4.95,17.15 | U$2.P2 2.23,2.41 v3.94,2.41
  Bottom 0.203: J1.D- 21.1,2.81 20.93,2.64 15.44,2.64 15.4,2.6 15.3,2.6 13.34,0.64 4.86,0.64 3.94,1.56 v3.94,2.41 3.94,16.13 v4.95,17.15
USBID  (via drill 0.51)
  Top 0.203: v18.92,20.38 18.92,19.46 IC1.33
  Bottom 0.203: 18.61,20.7 v18.92,20.38
VE_3V3  (via drill 0.35, 0.51)
  Top 0.203: U$2.P14 U$2.P15 4.19,15.09 | C5.1 16.54,19.43 | C1.1 27.81,23.24 27.39,22.82 IC1.19 27.39,20.24 26.54,19.43 | C4.1 23.37,23.24 23.89,22.72 IC1.26 23.89,19.95 v23.37,19.43 | C2.1 32.1,15.94 31.69,16.37 IC1.10 29.52,16.37 29.24,16.1 28.45,16.1 27.65,16.89 v24,16.89 | R7.2 29.88,3.4 30.35,2.92 ICSP.2 | C9.1 15.35,16.57 15.67,16.89 20.67,16.89 v20.83,16.89 | v20.83,16.89 20.83,17.53 19.98,18.37 IC1.35 17.12,18.37 16.62,18.88 16.62,19.57 C5.1 | IC1.38 20.65,16.87 v20.83,16.89 | IC1.57 24.89,8.39 v25.27,8 | R9.2 C6.1 9.99,4.53 10.16,4.7 | R9.2 | R8.2 R9.2 | 10.16,4.7 10.16,6.26 IC3.4 10.44,6.83 v10.03,7.24 | v23.37,4.51 14.8,4.51 14.35,4.95 10.41,4.95 10.16,4.7 | 15.57,20.4 15.75,20.22 16.49,19.48 C5.1 | 4.19,15.09 7.26,15.09 v7.49,14.86 | 5.21,22.99 6.48,22.99 7.21,23.72 U$3.5 | 4.23,18.89 U$9.1 | U$9.1 4.95,18.18 4.22,17.45 4.22,15.12 4.19,15.09 | C12.1 R3.1 5.21,22.99 | U$9.1 6.73,18.89 v6.73,18.67 | v5.21,21.97 5.21,22.99
  Bottom 0.203: 23.37,16.89 v23.37,19.43 | 23.37,16.89 v20.83,16.89 | v23.37,19.43 | 23.37,8 23.37,8.32 | 23.37,8.32 23.37,16.89 | 23.05,4.51 v23.37,4.51 | ICSP.2 30.35,2.92 29.08,4.19 24,4.19 | 23.37,4.19 23.68,4.19 | 23.68,4.19 23.84,4.19 | 23.37,16.89 v24,16.89 | 23.37,16.89 v23.37,19.43 | 23.37,8 23.68,8 | 23.68,8 v25.27,8 | v23.37,4.51 23.37,4.67 | 23.37,4.83 23.37,4.67 | 23.37,4.83 23.37,7.68 | 23.37,7.68 23.37,8 | v23.37,4.51 23.37,4.19 | v23.37,4.51 23.68,4.19 | 23.05,4.51 23.37,4.83 | 23.05,4.51 23.37,4.19 | 23.37,4.67 23.84,4.19 | 24,4.19 23.84,4.19 | 23.37,4.83 24,4.19 | 23.68,8 23.37,8.32 | 23.37,7.68 23.68,8 | v7.49,14.86 10.03,12.32 v10.03,7.24 | v6.73,18.67 6.73,21.97 v5.21,21.97
  pour Top (isolate 0.254, no thermals): 20.83,22.61 23.37,22.61 24,21.97 24,18.8 24.32,18.48 25.91,18.48 25.91,19.27 26.7,20.07 29.08,20.07 29.08,16.26 18.92,16.26 18.92,18.8 20.83,18.8
VEXTERN  (via drill 0.35)
  Top 0.203: IC2.1 52.45,1.91 52.45,5.46 52.2,5.71 IC2.4 | IC2.11 46.1,5.71 46.35,5.97 46.35,6.73 | 46.35,6.73 46.35,9.27 46.1,9.53 | IC2.8 46.1,9.53 | 38.95,13.02 C10.1 39.22,13.29 39.51,13.29 40.67,14.45 RN2.1 41.88,14.45 D1.C D2.C | D2.C | D2.C 45.21,13.21 v45.09,13.08 | v47.12,9.53 46.1,9.53 | IO.9 61.59,13.72 v61.59,6.73 | IC2.4 v54.99,5.71 | IC2.4 v48.89,5.71 | v47.37,6.73 46.35,6.73
  Bottom 0.203: v45.09,13.08 45.09,11.56 v47.12,9.53 | v61.59,6.73 61.34,6.48 55.75,6.48 v54.99,5.71 | v48.89,5.71 48.39,5.71 v47.37,6.73
VREGEN  (via drill 0.35)
  Top 0.203: VR2.3 | IC1.22 25.89,26.4 25.91,26.42 32.26,26.42 v32.64,26.04 | v34.44,23.24 35.27,24.07 VR2.3 | VR2.3 35.78,23.16 36.61,22.33 36.61,20.53 36.4,20.32 35.98,20.32 VR3.3
  Bottom 0.203: v34.44,23.24 34.44,24.23 33.68,24.23 32.64,25.27 v32.64,26.04
VUSB  (via drill 0.35)
  Top 0.203: VR3.1 34.23,21.91 33.66,22.48 v32.46,24.08 | RN1.5 38.82,7.09 C3.1 41.43,1.91 IC2.14 v47.37,1.91 | 14.9,22.73 R15.1 14.12,21.65 C17.1 11.59,21.12 D3.C | 14.9,22.73 R11.1 14.9,24.65 C14.+ | 14.9,22.73 19.73,22.73 v19.94,22.53 | 32.56,24.08 v32.46,24.08 | v37.21,25.02 36.26,25.97 VR2.1 35.78,26.04 33.68,26.04 32.46,24.82 v32.46,24.08 | D3.C 10.66,22.27 R5.2 10.45,23.32 C16.1 | v20.95,5.97 20.95,7.24 v18.67,9.53 | v10.79,18.67 10.66,18.8 D3.C
  Bottom 0.203: v19.94,22.53 31.93,22.53 31.93,23.55 v32.46,24.08 | v47.37,1.91 58.7,1.91 62.33,5.54 62.33,12.54 62.61,12.83 62.61,24.26 60.58,26.29 43.33,26.29 42.87,26.66 38.99,26.66 v37.21,25.02 | J1.VBUS 21.75,5.18 v20.95,5.97 | v18.67,9.53 12.15,16.05 12.15,16.7 10.79,18.05 v10.79,18.67

### Text on the board
tPlace: Ian Lesnet | I+S 2010 | v.trocio | Jun | 2010
bPlace: CC-BY-SA
bNames: Fulfillment by | Seeed Studio | www.seeedstudio.com | MCLR | +3.3V | GND | PGD | PGC | Bus Pirate v4.0
tValues: vimark
Reference: I/O header | EXT PWR | USB-OTG | V+ - GND | GND | +5v | +3v | Vpu | ADC | AUX2 | USB | AUX1 | AUX | CS | MISO | CLK | MOSI | MCLR | +3.3V | GND | DATA | CLOCK | BUS PIRATE V4.0 | CC-BY-SA | Ian Lesnet 2010 | Programming Header | http://dangerousprototypes.com